# Altium schematic sheet 12.SATA接口.SchDoc
size A4; SheetNumber: 12; SheetTotal: 13
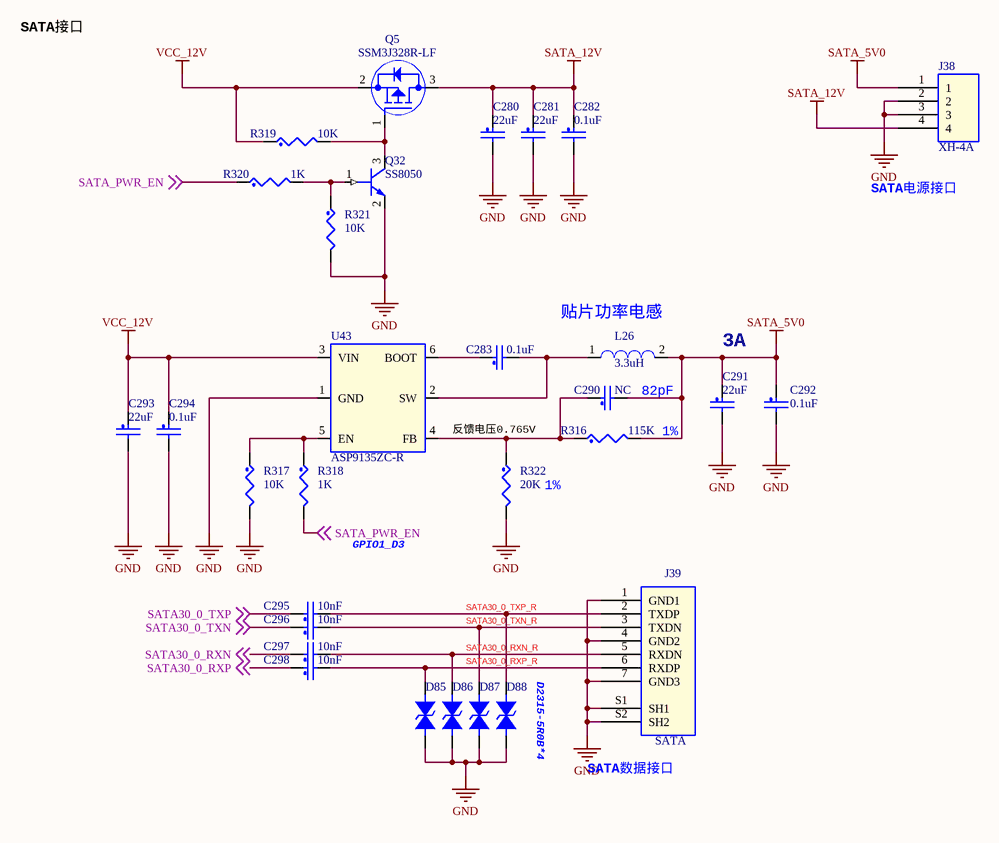
[diagram p0: 12.SATA接口.SchDoc]

## Parts
C280  22uF  [C0805]
C281  22uF  [C0805]
C282  0.1uF  [C0402]
C283  0.1uF  [C0402]
C290  NC  [C0402]
C291  22uF  [C0603]
C292  0.1uF  [C0402]
C293  22uF  [C0603]
C294  0.1uF  [C0402]
C295  10nF  [C0402]
C296  10nF  [C0402]
C297  10nF  [C0402]
C298  10nF  [C0402]
D85  D2315-5R0B  [esd0402]  (value not drawn)
D86  D2315-5R0B  [esd0402]  (value not drawn)
D87  D2315-5R0B  [esd0402]  (value not drawn)
D88  D2315-5R0B  [esd0402]  (value not drawn)
J38  XH-4A  [XH2p54-4p]
J39  SATA  [ssata_v]
L26  3.3uH  [l4520]
Q5  SSM3J328R-LF  [SOT23]
Q32  SS8050  [SOT23]
R316  115K  [R0402]
R317  10K  [R0402]
R318  1K  [R0402]
R319  10K  [R0402]
R320  1K  [R0402]
R321  10K  [R0402]
R322  20K  [R0402]
U43  ASP9135ZC-R  [SOT23_6]

## Nets
GND: C280.2 C281.2 C282.2 C291.2 C292.2 C293.2 C294.2 D85.1 D86.1 D87.1 D88.1 J38.2 J38.3 J39.1(GND1) J39.4(GND2) J39.7(GND3) J39.S1(SH1) J39.S2(SH2) Q32.2(EMITTER) R317.2 R321.2 R322.2 U43.1(GND)
SATA_5V0: C290.2 C291.1 C292.1 J38.1 L26.2 R316.2
SATA_12V: C280.1 C281.1 C282.1 J38.4 Q5.3(DRAIN)
VCC_12V: C293.1 C294.1 Q5.2(SOURCE) R319.1 U43.3(VIN)
SATA30_0_RXN: C297.1 ; off-sheet SATA30_0_RXN
SATA30_0_RXN_R: C297.2 D86.2 J39.5(RXDN)
SATA30_0_RXP: C298.1 ; off-sheet SATA30_0_RXP
SATA30_0_RXP_R: C298.2 D85.2 J39.6(RXDP)
SATA30_0_TXN: C296.1 ; off-sheet SATA30_0_TXN
SATA30_0_TXN_R: C296.2 D87.2 J39.3(TXDN)
SATA30_0_TXP: C295.1 ; off-sheet SATA30_0_TXP
SATA30_0_TXP_R: C295.2 D88.2 J39.2(TXDP)
SATA_PWR_EN: R318.2 R320.1 ; off-sheet SATA_PWR_EN
NetC283_1: C283.1 U43.6(BOOT)
NetC283_2: C283.2 L26.1 U43.2(SW)
NetC290_1: C290.1 R316.1 R322.1 U43.4(FB)
NetQ5_1: Q5.1(GATE) Q32.3(COLLECTOR) R319.2
NetQ32_1: Q32.1(BASE) R320.2 R321.1
NetR317_1: R317.1 R318.1 U43.5(EN)

## Notes on the sheet
- SATA接口
- SATA电源接口
- (near L26) 贴片功率电感
- 3A
- 反馈电压0.765V
- 82pF
- 1%
- GPIO1_D3
- (near D88) D2315-5R0B*4
- (near J39) SATA数据接口

## Library data of the parts
C280-C283 C290-C298 = CAP_NP
D85-D88 = DIODE BI-DIR TRIG
J38 = 1X4PIN
L26 = IND
Q5 = MOSFET_P
Q32 = NPN
R316-R322 = RES
U43 = TP6327GS6